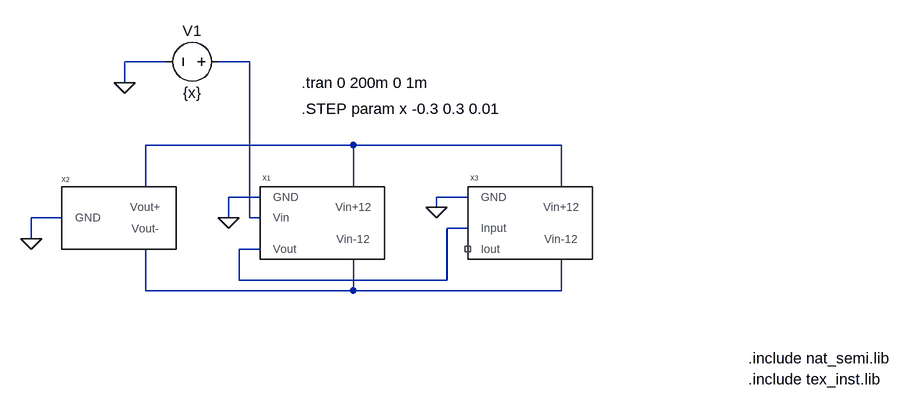
[diagram p0: schematic Diagram_with_Transformer.asc]
Diagram_with_Transformer.asc, the LTspice schematic file:
Version 4
SHEET 1 1044 752
WIRE -96 -48 -160 -48
WIRE 32 -48 -16 -48
WIRE -160 -16 -160 -48
WIRE 192 80 -128 80
WIRE 512 80 192 80
WIRE -128 144 -128 80
WIRE 192 144 192 80
WIRE 512 144 512 80
WIRE 48 160 0 160
WIRE 368 160 320 160
WIRE 320 176 320 160
WIRE -256 192 -304 192
WIRE 0 192 0 160
WIRE 32 192 32 -48
WIRE 48 192 32 192
WIRE 368 208 336 208
WIRE -304 224 -304 192
WIRE 48 240 16 240
WIRE 16 288 16 240
WIRE 336 288 336 208
WIRE 336 288 16 288
WIRE -128 304 -128 240
WIRE 192 304 192 256
WIRE 192 304 -128 304
WIRE 512 304 512 256
WIRE 512 304 192 304
FLAG 0 192 0
FLAG -304 224 0
FLAG 320 176 0
FLAG -160 -16 0
SYMBOL Component_3 -176 192 R0
SYMATTR InstName X2
SYMBOL Component_2 448 192 R0
SYMATTR InstName X3
SYMBOL voltage 0 -48 R90
WINDOW 0 -32 56 VBottom 2
WINDOW 3 32 56 VTop 2
SYMATTR InstName V1
SYMATTR Value {x}
SYMBOL Component_1 128 192 R0
SYMATTR InstName X1
TEXT 800 408 Left 2 !.include nat_semi.lib
TEXT 800 440 Left 2 !.include tex_inst.lib
TEXT 112 -16 Left 2 !.tran 0 200m 0 1m
TEXT 112 24 Left 2 !.STEP param x -0.3 0.3 0.01

The netlist it stands for:
* Diagram_with_Transformer.asc
XX2 N004 N002 0 Component_3  ; pins Vout- Vout+ GND
XX3 0 N003 N002 N004 NC_01 Component_2  ; pins GND Input Vin+12 Vin-12 Iout
V1 N001 0 {x}
XX1 0 N003 N002 N004 N001 Component_1  ; pins GND Vout Vin+12 Vin-12 Vin
.include nat_semi.lib
.include tex_inst.lib
.tran 0 200m 0 1m
.STEP param x -0.3 0.3 0.01
.backanno
.end